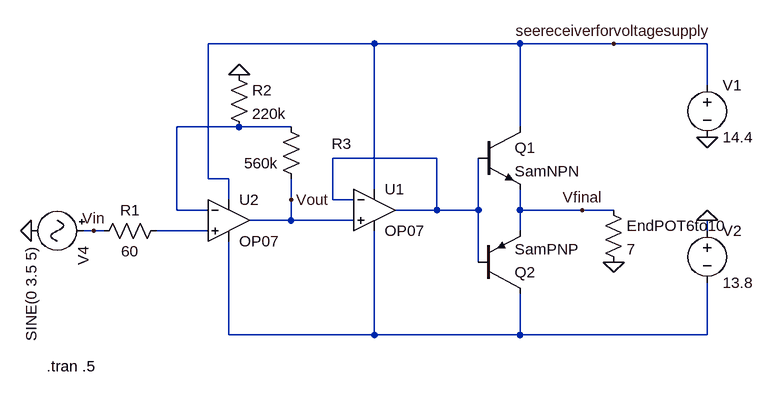
[diagram p0: schematic Draft1.asc]
Draft1.asc, the LTspice schematic file:
Version 4
SHEET 1 2168 784
WIRE 400 -96 144 -96
WIRE 624 -96 400 -96
WIRE 768 -96 624 -96
WIRE 912 -96 768 -96
WIRE 912 -32 912 -96
WIRE 192 32 96 32
WIRE 272 32 192 32
WIRE 624 32 624 -96
WIRE 496 80 336 80
WIRE 144 112 144 -96
WIRE 176 112 144 112
WIRE 400 128 400 -96
WIRE 176 144 176 112
WIRE 272 144 272 112
WIRE 336 144 336 80
WIRE 368 144 336 144
WIRE 96 160 96 32
WIRE 144 160 96 160
WIRE 496 160 496 80
WIRE 496 160 432 160
WIRE 560 160 560 80
WIRE 560 160 496 160
WIRE 624 160 624 128
WIRE 720 160 624 160
WIRE 768 160 720 160
WIRE 272 176 272 144
WIRE 272 176 208 176
WIRE 368 176 272 176
WIRE -32 192 -48 192
WIRE -16 192 -32 192
WIRE 144 192 64 192
WIRE 624 192 624 160
WIRE 912 192 912 176
WIRE 560 240 560 160
WIRE 176 352 176 208
WIRE 400 352 400 192
WIRE 400 352 176 352
WIRE 624 352 624 288
WIRE 624 352 400 352
WIRE 912 352 912 272
WIRE 912 352 624 352
FLAG 192 -48 0
FLAG 272 144 Vout
FLAG 912 48 0
FLAG 912 176 0
FLAG 720 160 Vfinal
FLAG -32 192 Vin
FLAG -128 192 0
FLAG 768 -96 seereceiverforvoltagesupply
FLAG 768 240 0
SYMBOL res 176 -64 R0
SYMATTR InstName R2
SYMATTR Value 220k
SYMBOL res 288 128 R180
WINDOW 0 -77 70 Left 2
WINDOW 3 36 40 Left 2
SYMATTR InstName R3
SYMATTR Value 560k
SYMBOL Misc\\signal -32 192 R90
WINDOW 123 0 0 Left 0
WINDOW 39 0 0 Left 0
SYMATTR InstName V4
SYMATTR Value SINE(0 3.5 5)
SYMBOL res 80 176 R90
WINDOW 0 0 56 VBottom 2
WINDOW 3 32 56 VTop 2
SYMATTR InstName R1
SYMATTR Value 60
SYMBOL npn 560 32 R0
SYMATTR InstName Q1
SYMATTR Value SamNPN
SYMBOL pnp 560 288 M180
SYMATTR InstName Q2
SYMATTR Value SamPNP
SYMBOL res 752 144 R0
SYMATTR InstName EndPOT6to10
SYMATTR Value 7
SYMBOL voltage 912 -48 R0
WINDOW 123 0 0 Left 0
WINDOW 39 24 124 Left 2
SYMATTR InstName V1
SYMATTR Value 14.4
SYMBOL voltage 912 176 R0
WINDOW 123 0 0 Left 0
WINDOW 39 0 0 Left 0
SYMATTR InstName V2
SYMATTR Value 13.8
SYMBOL OpAmps\\OP07 400 96 R0
SYMATTR InstName U1
SYMBOL OpAmps\\OP07 176 112 R0
SYMATTR InstName U2
TEXT -104 400 Left 2 !.tran .5

The netlist it stands for:
* Draft1.asc
R2 0 N001 220k
R3 Vout N001 560k
V4 Vin 0 SINE(0 3.5 5)
R1 N003 Vin 60
Q1 seereceiverforvoltagesupply N002 Vfinal 0 SamNPN
Q2 N004 N002 Vfinal 0 SamPNP
R§EndPOT6to10 Vfinal 0 7
V1 seereceiverforvoltagesupply 0 14.4
V2 0 N004 13.8
XU1 Vout N002 seereceiverforvoltagesupply N004 N002 LT1001  ; OP07, pins In+ In- V+ V- OUT
XU2 N003 N001 seereceiverforvoltagesupply N004 Vout LT1001  ; OP07, pins In+ In- V+ V- OUT
.model NPN NPN
.model PNP PNP
.lib standard.bjt
.tran .5
.lib LTC.lib
.backanno
.end